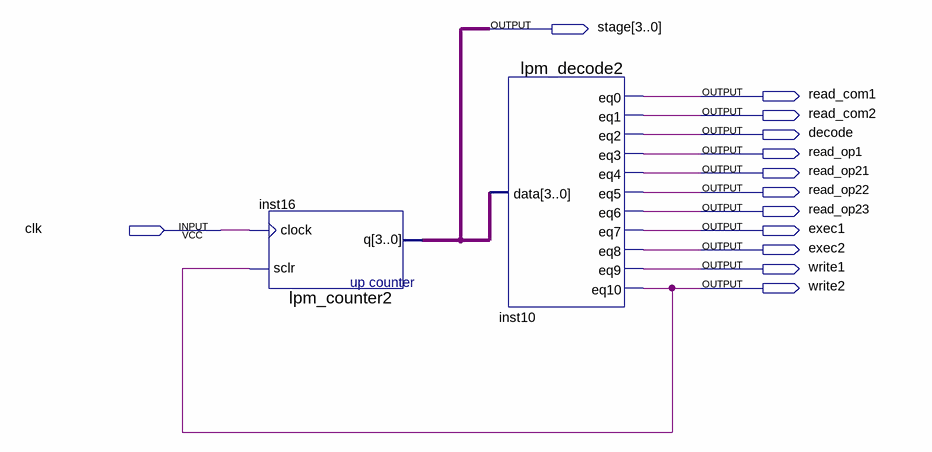
[diagram p0: schematic sheet]
// Quartus schematic cu.bdf as structural Verilog: 2 symbols, 13 pins
module cu (
  input  clk,
  output [3:0] stage,
  output read_com1,
  output read_com2,
  output decode,
  output read_op1,
  output read_op21,
  output read_op22,
  output read_op23,
  output exec1,
  output exec2,
  output write1,
  output write2
);

  lpm_counter2 inst16 (.sclr(write2), .clock(clk), .q(stage));
  lpm_decode2 inst10 (
    .data(stage), .eq0(read_com1), .eq1(read_com2), .eq2(decode), .eq3(read_op1), .eq4(read_op21),
    .eq5(read_op22), .eq6(read_op23), .eq7(exec1), .eq8(exec2), .eq9(write1), .eq10(write2));
endmodule
